# EAGLE design USBm1P_0v0 (EAGLE 9.6.2)
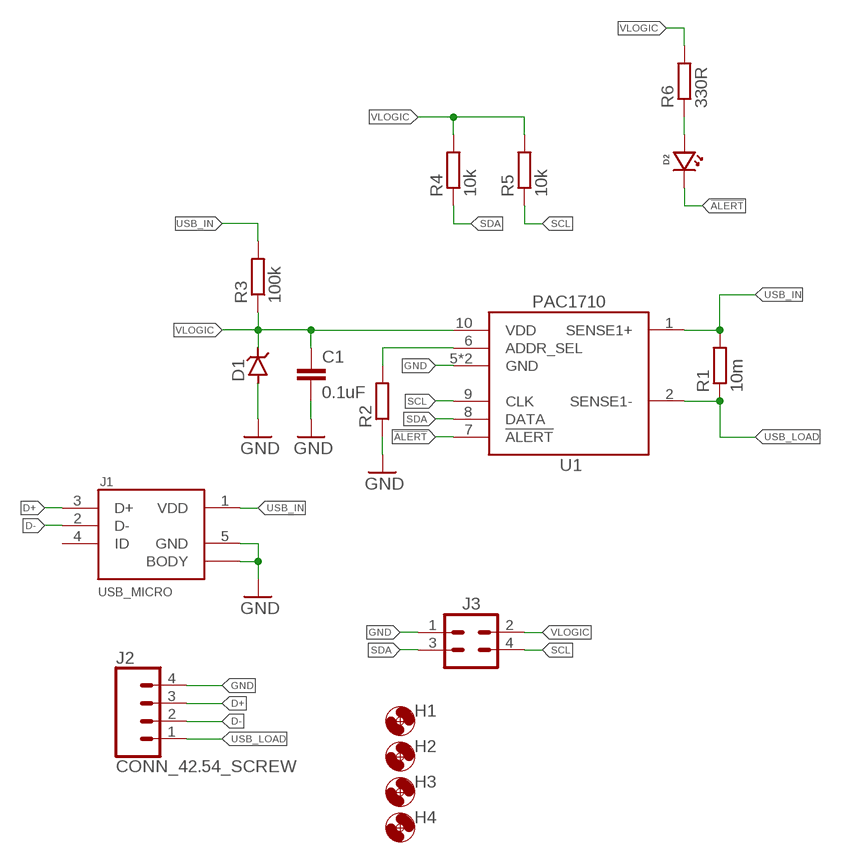
[diagram p0: schematic, sheet 1]

## Parts
C1  0.1uF  C-EU0.1UFC0603  [C0603]
D1  DIODE_ZENERSOD-123  [SOD-123]
D2  LED1206_BOTTOM  [LED_1206_BOTTOM]
H1  MOUNTING_HOLE2_NP  [2_56]
H2  MOUNTING_HOLE2_NP  [2_56]
H3  MOUNTING_HOLE2_NP  [2_56]
H4  MOUNTING_HOLE2_NP  [2_56]
J1  USB_MICRO  [10118194-0001LF_10118194-0001LF_LONGER_PADS]
J2  CONN_42.54_SCREW  [1X04_SCREW]
J3  CONN_2X2MIRCOFIT_RT  [2X2_MICROFIT_RT]
R1  10m  R-EU_0.01R0805  [R0805]
R2  R-EU_R0603  [R0603]
R3  100k  R-EU_100KR0603  [R0603]
R4  10k  R-EU_10KR0603  [R0603]
R5  10k  R-EU_10KR0603  [R0603]
R6  330R  R-EU_330R0603  [R0603]
U1  PAC1710  [VDFN-10]

## Nets
!ALERT: D2.CATHODE U1.7(!ALERT)
D+: J1.3(D+) J2.3
D-: J1.2(D-) J2.2
GND: C1.2 D1.ANODE(A) J1.5(GND) J1.BODY@1(BODY) J1.BODY@2(BODY) J1.BODY@3(BODY) J1.BODY@4(BODY) J1.BODY@7(BODY) J1.BODY@8(BODY) J2.4 J3.1 R2.1 U1.5(GND) U1.EP(GND)
N$1: R2.2 U1.6(ADDR_SEL)
N$2: D2.ANODE R6.1
SCL: J3.4 R5.1 U1.9(CLK)
SDA: J3.3 R4.1 U1.8(DATA)
USB_IN: J1.1(VDD) R1.2 R3.2 U1.1(SENSE1+)
USB_LOAD: J2.1 R1.1 U1.2(SENSE1-)
VLOGIC: C1.1 D1.CAT(C) J3.2 R3.1 R4.2 R5.2 R6.2 U1.10(VDD)
Unconnected: J1.4(ID)

## Library data of the parts
C1 = bschulz_passives:C-EU: CAPACITOR, European symbol; DIGIKEY: 490-6051-1-ND; MF: Murata; MPN: GCM188R71E104KA57D
D1 = bschulz:DIODE_ZENER: Generic Zener Diode
D2 = bschulz:LED: Genaric LED
H1-H4 = bschulz:MOUNTING_HOLE: Genaric Mechanical Mounting Hole Hole diameter based on max body diameter + 15% Keepout ring is for diameter of socket cap screw (minimum required clearance) TPlace ring is for diameter of pan head screw (recomended clearance) Specifications: Socket Cap <http://fastener-express.com/fastener-technical/SocketscapSS-Alloy.pdf> Button Head Socket Cap <http://fastener-express.com/fastener-technical/Button-Socket-alloy.pdf> Pan Head <http://fastener-express.com/fastener-technical/pan-machine-Screws.pdf>; DIGIKEY: DNP; MF: N/A; MPN: DNP
J1 = bschulz:USB_MICRO: General Micro USB - AB Connector; DIGIKEY: 609-4618-1-ND; MF: Amphenol; MPN: 10118194-0001LF
J2 = bschulz:CONN_4: Genaric 4 terminal header Digikey 2.54_SCREW <https://www.digikey.com/product-detail/en/on-shore-technology-inc/OSTVN04A150/ED10563-ND/1588864>; DIGIKEY: ED10563-ND; MF: On Shore; MPN: OSTVN04A150
J3 = bschulz:CONN_2X2: Genaric 2x2 terminal header; DIGIKEY: WM1814-ND; MF: Molex; MPN: 0430450400
R1 = bschulz_passives:R-EU_: RESISTOR, European symbol Digikey Parts: Yageo, 0402 <https://www.digikey.com/products/en/resistors/chip-resistor-surface-mount/52?k=&pkeyword=&sv=0&s=4356&sf=1&FV=-1%7C13%2C7%7C2%2C1291%7C39157%2C1989%7C0%2C-8%7C52%2C3%7C1131%2C3%7C2503&quantity=&ColumnSort=0&page=1&stock=1&pageSize=25> Yageo, 0603 <https://www.digikey.com/products/en/resistors/chip-resistor-surface-mount/52?k=&pkeyword=&sv=0&pv1291=39245&sf=1&FV=-5%7C4356%2C-5%7C47360%2C-8%7C52%2C-1%7C13%2C7%7C2%2C1989%7C0&quantity=10&ColumnSort=1000011&page=1&stock=1&pageSize=25> Panasonic, 0603 <https://www.digikey.com/products/en/resistors/chip-resistor-surface-mount/52?k=&pkeyword=&pv252=68&sf=0&FV=ffec373d%2C1c0002%2C142c040c%2C1f140000%2Cffe00034%2C80002%2Cc0001&quantity=&ColumnSort=0&page=1&stock=1&pageSize=25> Panasonic, precision, 0603 <https://www.digikey.com/products/en/resistors/chip-resistor-surface-mount/52?FV=ffec4907%2Cfffc000a%2Cc0172%2C142c040c%2C1f140000%2Cffe00034%2C1c0002&quantity=100&ColumnSort=2085&page=1&stock=1&pageSize=25> Panasonic, 0805 <https://www.digikey.com/products/en/resistors/chip-resistor-surface-mount/52?k=&pkeyword=&pv3=1&sf=0&FV=ffec373d%2C1c0002%2C1f140000%2Cffe00034%2C142c040d&quantity=&ColumnSort=0&page=1&stock=1&pageSize=25> Rohm, current sense <https://www.digikey.com/products/en/resistors/chip-resistor-surface-mount/52?k=&pkeyword=&pv3=1&sf=0&FV=ffecb688%2C1f140000%2Cffe00034%2C1c0002&quantity=&ColumnSort=0&page=1&stock=1&pageSize=25> Vishay, pulse proof automotive <https://www.digikey.com/products/en/resistors/chip-resistor-surface-mount/52?k=&pkeyword=&pv7=2&sf=0&FV=ffec5d6b%2Cffe00034%2C1f140000&quantity=&ColumnSort=0&page=1&stock=1&pageSize=25>; DIGIKEY: CRF0805-FZ-R010ELFCT-ND; MF: Bourns; MPN: CRF0805-FZ-R010ELF
R2 = bschulz_passives:R-EU_: RESISTOR, European symbol Digikey Parts: Yageo, 0402 <https://www.digikey.com/products/en/resistors/chip-resistor-surface-mount/52?k=&pkeyword=&sv=0&s=4356&sf=1&FV=-1%7C13%2C7%7C2%2C1291%7C39157%2C1989%7C0%2C-8%7C52%2C3%7C1131%2C3%7C2503&quantity=&ColumnSort=0&page=1&stock=1&pageSize=25> Yageo, 0603 <https://www.digikey.com/products/en/resistors/chip-resistor-surface-mount/52?k=&pkeyword=&sv=0&pv1291=39245&sf=1&FV=-5%7C4356%2C-5%7C47360%2C-8%7C52%2C-1%7C13%2C7%7C2%2C1989%7C0&quantity=10&ColumnSort=1000011&page=1&stock=1&pageSize=25> Panasonic, 0603 <https://www.digikey.com/products/en/resistors/chip-resistor-surface-mount/52?k=&pkeyword=&pv252=68&sf=0&FV=ffec373d%2C1c0002%2C142c040c%2C1f140000%2Cffe00034%2C80002%2Cc0001&quantity=&ColumnSort=0&page=1&stock=1&pageSize=25> Panasonic, precision, 0603 <https://www.digikey.com/products/en/resistors/chip-resistor-surface-mount/52?FV=ffec4907%2Cfffc000a%2Cc0172%2C142c040c%2C1f140000%2Cffe00034%2C1c0002&quantity=100&ColumnSort=2085&page=1&stock=1&pageSize=25> Panasonic, 0805 <https://www.digikey.com/products/en/resistors/chip-resistor-surface-mount/52?k=&pkeyword=&pv3=1&sf=0&FV=ffec373d%2C1c0002%2C1f140000%2Cffe00034%2C142c040d&quantity=&ColumnSort=0&page=1&stock=1&pageSize=25> Rohm, current sense <https://www.digikey.com/products/en/resistors/chip-resistor-surface-mount/52?k=&pkeyword=&pv3=1&sf=0&FV=ffecb688%2C1f140000%2Cffe00034%2C1c0002&quantity=&ColumnSort=0&page=1&stock=1&pageSize=25> Vishay, pulse proof automotive <https://www.digikey.com/products/en/resistors/chip-resistor-surface-mount/52?k=&pkeyword=&pv7=2&sf=0&FV=ffec5d6b%2Cffe00034%2C1f140000&quantity=&ColumnSort=0&page=1&stock=1&pageSize=25>; MF: Yageo
R3 = bschulz_passives:R-EU_: RESISTOR, European symbol Digikey Parts: Yageo, 0402 <https://www.digikey.com/products/en/resistors/chip-resistor-surface-mount/52?k=&pkeyword=&sv=0&s=4356&sf=1&FV=-1%7C13%2C7%7C2%2C1291%7C39157%2C1989%7C0%2C-8%7C52%2C3%7C1131%2C3%7C2503&quantity=&ColumnSort=0&page=1&stock=1&pageSize=25> Yageo, 0603 <https://www.digikey.com/products/en/resistors/chip-resistor-surface-mount/52?k=&pkeyword=&sv=0&pv1291=39245&sf=1&FV=-5%7C4356%2C-5%7C47360%2C-8%7C52%2C-1%7C13%2C7%7C2%2C1989%7C0&quantity=10&ColumnSort=1000011&page=1&stock=1&pageSize=25> Panasonic, 0603 <https://www.digikey.com/products/en/resistors/chip-resistor-surface-mount/52?k=&pkeyword=&pv252=68&sf=0&FV=ffec373d%2C1c0002%2C142c040c%2C1f140000%2Cffe00034%2C80002%2Cc0001&quantity=&ColumnSort=0&page=1&stock=1&pageSize=25> Panasonic, precision, 0603 <https://www.digikey.com/products/en/resistors/chip-resistor-surface-mount/52?FV=ffec4907%2Cfffc000a%2Cc0172%2C142c040c%2C1f140000%2Cffe00034%2C1c0002&quantity=100&ColumnSort=2085&page=1&stock=1&pageSize=25> Panasonic, 0805 <https://www.digikey.com/products/en/resistors/chip-resistor-surface-mount/52?k=&pkeyword=&pv3=1&sf=0&FV=ffec373d%2C1c0002%2C1f140000%2Cffe00034%2C142c040d&quantity=&ColumnSort=0&page=1&stock=1&pageSize=25> Rohm, current sense <https://www.digikey.com/products/en/resistors/chip-resistor-surface-mount/52?k=&pkeyword=&pv3=1&sf=0&FV=ffecb688%2C1f140000%2Cffe00034%2C1c0002&quantity=&ColumnSort=0&page=1&stock=1&pageSize=25> Vishay, pulse proof automotive <https://www.digikey.com/products/en/resistors/chip-resistor-surface-mount/52?k=&pkeyword=&pv7=2&sf=0&FV=ffec5d6b%2Cffe00034%2C1f140000&quantity=&ColumnSort=0&page=1&stock=1&pageSize=25>; DIGIKEY: 311-100KHRCT-ND; MF: Yageo; MPN: RC0603FR-07100KL; VALUE_PART: 100k
R4 R5 = bschulz_passives:R-EU_: RESISTOR, European symbol Digikey Parts: Yageo, 0402 <https://www.digikey.com/products/en/resistors/chip-resistor-surface-mount/52?k=&pkeyword=&sv=0&s=4356&sf=1&FV=-1%7C13%2C7%7C2%2C1291%7C39157%2C1989%7C0%2C-8%7C52%2C3%7C1131%2C3%7C2503&quantity=&ColumnSort=0&page=1&stock=1&pageSize=25> Yageo, 0603 <https://www.digikey.com/products/en/resistors/chip-resistor-surface-mount/52?k=&pkeyword=&sv=0&pv1291=39245&sf=1&FV=-5%7C4356%2C-5%7C47360%2C-8%7C52%2C-1%7C13%2C7%7C2%2C1989%7C0&quantity=10&ColumnSort=1000011&page=1&stock=1&pageSize=25> Panasonic, 0603 <https://www.digikey.com/products/en/resistors/chip-resistor-surface-mount/52?k=&pkeyword=&pv252=68&sf=0&FV=ffec373d%2C1c0002%2C142c040c%2C1f140000%2Cffe00034%2C80002%2Cc0001&quantity=&ColumnSort=0&page=1&stock=1&pageSize=25> Panasonic, precision, 0603 <https://www.digikey.com/products/en/resistors/chip-resistor-surface-mount/52?FV=ffec4907%2Cfffc000a%2Cc0172%2C142c040c%2C1f140000%2Cffe00034%2C1c0002&quantity=100&ColumnSort=2085&page=1&stock=1&pageSize=25> Panasonic, 0805 <https://www.digikey.com/products/en/resistors/chip-resistor-surface-mount/52?k=&pkeyword=&pv3=1&sf=0&FV=ffec373d%2C1c0002%2C1f140000%2Cffe00034%2C142c040d&quantity=&ColumnSort=0&page=1&stock=1&pageSize=25> Rohm, current sense <https://www.digikey.com/products/en/resistors/chip-resistor-surface-mount/52?k=&pkeyword=&pv3=1&sf=0&FV=ffecb688%2C1f140000%2Cffe00034%2C1c0002&quantity=&ColumnSort=0&page=1&stock=1&pageSize=25> Vishay, pulse proof automotive <https://www.digikey.com/products/en/resistors/chip-resistor-surface-mount/52?k=&pkeyword=&pv7=2&sf=0&FV=ffec5d6b%2Cffe00034%2C1f140000&quantity=&ColumnSort=0&page=1&stock=1&pageSize=25>; DIGIKEY: 311-10.0KHRCT-ND; MF: Yageo; MPN: RC0603FR-0710KL; VALUE_PART: 10k
R6 = bschulz_passives:R-EU_: RESISTOR, European symbol Digikey Parts: Yageo, 0402 <https://www.digikey.com/products/en/resistors/chip-resistor-surface-mount/52?k=&pkeyword=&sv=0&s=4356&sf=1&FV=-1%7C13%2C7%7C2%2C1291%7C39157%2C1989%7C0%2C-8%7C52%2C3%7C1131%2C3%7C2503&quantity=&ColumnSort=0&page=1&stock=1&pageSize=25> Yageo, 0603 <https://www.digikey.com/products/en/resistors/chip-resistor-surface-mount/52?k=&pkeyword=&sv=0&pv1291=39245&sf=1&FV=-5%7C4356%2C-5%7C47360%2C-8%7C52%2C-1%7C13%2C7%7C2%2C1989%7C0&quantity=10&ColumnSort=1000011&page=1&stock=1&pageSize=25> Panasonic, 0603 <https://www.digikey.com/products/en/resistors/chip-resistor-surface-mount/52?k=&pkeyword=&pv252=68&sf=0&FV=ffec373d%2C1c0002%2C142c040c%2C1f140000%2Cffe00034%2C80002%2Cc0001&quantity=&ColumnSort=0&page=1&stock=1&pageSize=25> Panasonic, precision, 0603 <https://www.digikey.com/products/en/resistors/chip-resistor-surface-mount/52?FV=ffec4907%2Cfffc000a%2Cc0172%2C142c040c%2C1f140000%2Cffe00034%2C1c0002&quantity=100&ColumnSort=2085&page=1&stock=1&pageSize=25> Panasonic, 0805 <https://www.digikey.com/products/en/resistors/chip-resistor-surface-mount/52?k=&pkeyword=&pv3=1&sf=0&FV=ffec373d%2C1c0002%2C1f140000%2Cffe00034%2C142c040d&quantity=&ColumnSort=0&page=1&stock=1&pageSize=25> Rohm, current sense <https://www.digikey.com/products/en/resistors/chip-resistor-surface-mount/52?k=&pkeyword=&pv3=1&sf=0&FV=ffecb688%2C1f140000%2Cffe00034%2C1c0002&quantity=&ColumnSort=0&page=1&stock=1&pageSize=25> Vishay, pulse proof automotive <https://www.digikey.com/products/en/resistors/chip-resistor-surface-mount/52?k=&pkeyword=&pv7=2&sf=0&FV=ffec5d6b%2Cffe00034%2C1f140000&quantity=&ColumnSort=0&page=1&stock=1&pageSize=25>; DIGIKEY: 311-330HRCT-ND; MF: Yageo; MPN: RC0603FR-07330RL; VALUE_PART: 330
U1 = bschulz:PAC1710: PAC1710 - High Side Current/Power Monitor with I2C Interface Characteristics: Vcc: 3V ~ 5.5V Iq: 5uA Common Mode Range: 0V ~ 40V Operating Temperature: -40°C to 85°C Digikey: PAC1720-1-AIA-CT-ND <https://www.digikey.com/product-detail/en/microchip-technology/PAC1710-1-AIA-TR/PAC1710-1-AIA-CT-ND/4490171>; DIGIKEY: PAC1710-1-AIA-CT-ND; MF: Microchip; MPN: PAC1710-1-AIA-TR

## Board
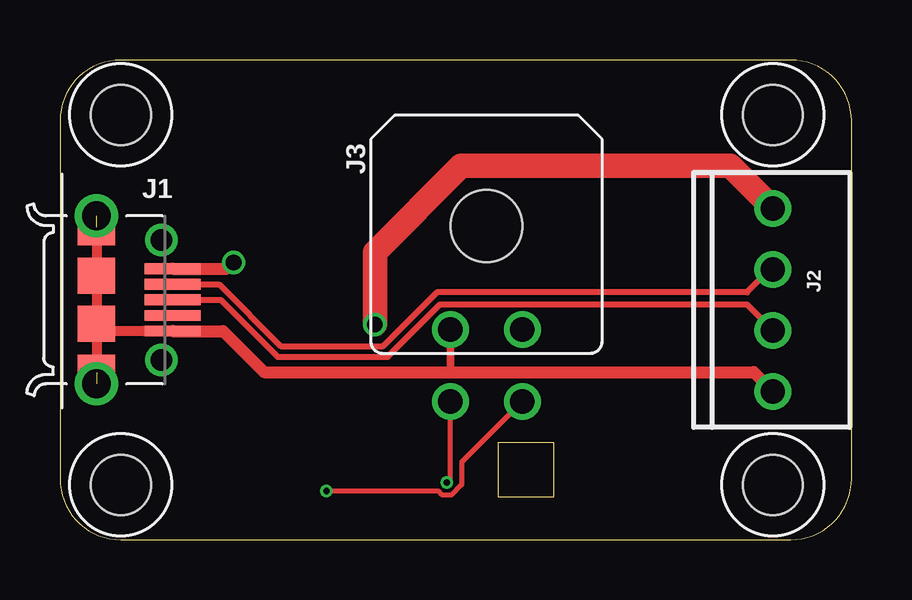
[diagram p1: board, top side]
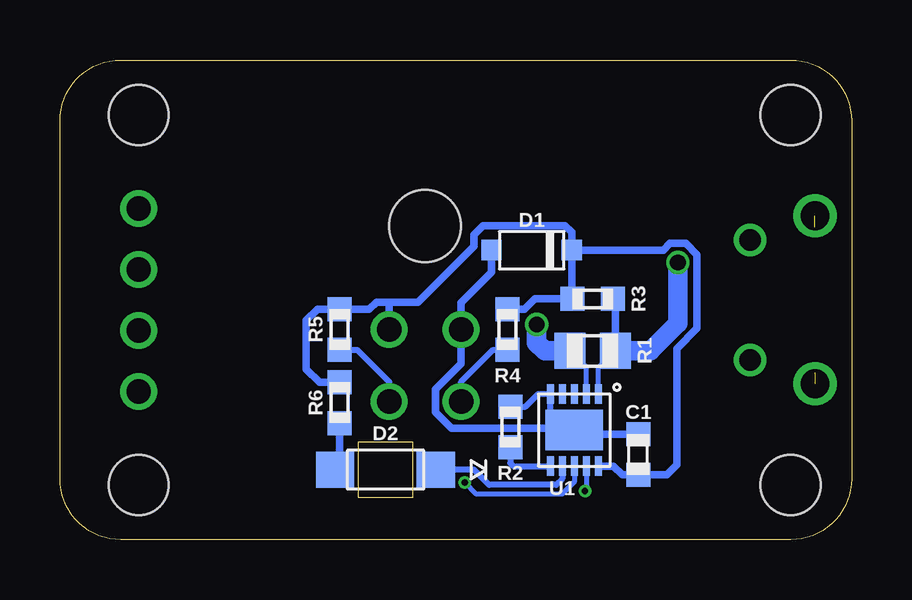
[diagram p2: board, bottom side, seen from below]

Size 33 x 19.99 mm. Coordinates in mm from the lower left corner, seen from the top.
Outline: 33,2.54 33,17.45 arc90 30.46,19.99 2.54,19.99 arc90 0,17.45 0,2.54 arc90 2.54,0 30.46,0 arc90 33,2.54
Copper layers (1*16): Top 0.035559375mm / dielectric 1.6mm / Bottom 0.035559375mm
Design rules "oshpark-2layer": minimum track width 6mil, minimum drill 10mil, track to track 6mil, track to pad 6mil, pad to pad 6mil, via to via 6mil, smd to smd 6mil, copper to edge 15mil, drill to drill 6mil, minimum pad ring 5mil, minimum via ring 5mil, stop-mask expansion 2.5mil, vias tented up to drill 0mil, thermal gap 10mil

### Footprints (pad centres in the part's own frame; a part is rotated, then mirrored left to right if it is on the bottom)
C0603 = smd 1 x 1: 1 -0.85,0; 2 0.85,0
SOD-123 = smd 0.85 x 0.85: ANODE 1.675,0; CAT -1.675,0
LED_1206_BOTTOM = smd 1.6 x 1.5: ANODE 2.1,0; CATHODE -2.1,0
2_56 = hole 2.5: 0,0
10118194-0001LF_10118194-0001LF_LONGER_PADS = smd 0.45 x 2.35: 1 -1.3,3.175; 2 -0.65,3.175; 3 0,3.175; 4 0.65,3.175; 5 1.3,3.175 | drill 0.9: BBODY@1 -2.5,2.7; BBODY@2 2.5,2.7 | drill 1.2: BODY@1 -3.5,0; BODY@4 3.5,0 | smd 1.5 x 1.55: BODY@2 -1,0; BODY@3 1,0; BODY@7 -3.032,0; BODY@8 3.032,0
1X04_SCREW = drill 1.016: 1 -3.81,0; 2 -1.27,0; 3 1.27,0; 4 3.81,0
2X2_MICROFIT_RT = drill 1.02: 1 1.5,4.32; 2 -1.5,4.32; 3 1.5,7.32; 4 -1.5,7.32 | hole 3: 0,0
R0805 = smd 1.3 x 1.5: 1 -0.95,0; 2 0.95,0
R0603 = smd 1 x 1: 1 -0.85,0; 2 0.85,0
VDFN-10 = smd 0.8 x 0.3: 1 -1.5,1; 2 -1.5,0.5; 3 -1.5,0; 4 -1.5,-0.5; 5 -1.5,-1; 6 1.5,-1; 7 1.5,-0.5; 8 1.5,0; 9 1.5,0.5; 10 1.5,1 | smd 1.7 x 2.4: EP 0,0

### Placement (x,y rotation side)
C1  8.89,3.56 90 bottom
D1  13.34,12.06 180 bottom
D2  19.43,2.92 180 bottom
H1  29.72,2.29 0 top
H2  29.72,17.7 0 top
H3  2.54,2.29 0 top
H4  2.54,17.7 0 top
J1  1.52,9.99 270 top
J2  29.72,9.99 270 top
J3  17.78,13.08 180 top
R1  10.79,7.87 0 bottom
R2  14.22,4.7 270 bottom
R3  10.79,10.03 0 bottom
R4  14.35,8.76 90 bottom
R5  21.34,8.76 90 bottom
R6  21.34,5.71 90 bottom
U1  11.56,4.57 270 bottom

### Tracks (layer width: path | path; a pad name or v marks a point on that pad's centre or on a via)
!ALERT
  Bottom 0.254: U1.7 12.06,2.55 12.32,2.29 15.11,2.29 15.75,2.92 D2.CATHODE
D+
  Top 0.254: J2.3 28.64,9.8 15.85,9.8 13.66,7.62 9.08,7.62 6.7,9.99 J1.3
D-
  Top 0.254: J2.2 29.59,11.27 28.64,10.31 15.71,10.31 13.48,8.07 9.2,8.07 6.63,10.64 J1.2
GND  (2 unrouted)
  Top 0.305: J3.1 16.28,7.01 16.26,6.99
  Top 0.406: J1.BODY@7 J1.BODY@2 J1.BODY@3 | J1.BODY@3 J1.BODY@4 | J1.5 1.82,8.7 J1.BODY@3
  Top 0.508: J1.5 6.8,8.7 8.51,6.99 16.26,6.99 28.92,6.99 J2.4
  Bottom 0.254: 12.45,4.57 12.56,4.68 U1.5 13.06,6.07 13.59,5.55 R2.1 | 12.45,4.57 12.06,4.19 | U1.EP 12.45,4.57
  Bottom 0.305: C1.2 11.39,4.41 U1.EP 11.64,4.65 16.69,4.65 17.35,5.32 17.35,6.27 16.28,7.34 J3.1 16.28,9.88 15.01,11.15 D1.ANODE
N$1
  Bottom 0.254: R2.2 14.22,3.19 14.1,3.07 U1.6
N$2
  Bottom 0.305: D2.ANODE 21.34,3.12 R6.1
SCL  (via drill 0.25)
  Top 0.2: v11.11,2.03 15.76,2.03 15.91,1.88 16.33,1.88 16.74,2.29 16.74,3.22 J3.4
  Bottom 0.2: U1.9 11.06,2.08 v11.11,2.03
  Bottom 0.254: R5.1 20.61,7.91 19.28,6.58 J3.4
SDA  (via drill 0.25)
  Top 0.2: v16.12,2.39 16.28,2.54 J3.3
  Bottom 0.2: U1.8 11.56,2.41 12.06,1.91 15.64,1.91 v16.12,2.39
  Bottom 0.254: J3.3 16.28,6.58 14.95,7.91 R4.1
USB_IN  (via drill 0.65)
  Top 0.508: J1.1 6.98,11.29 v7.24,11.56
  Bottom 0.2: U1.1 10.56,7.16 R1.2
  Bottom 0.305: R1.2 9.85,9.93 R3.2
  Bottom 0.813: v7.24,11.56 7.24,9.02 8.38,7.87 R1.2
USB_LOAD  (via drill 0.65)
  Top 1.016: J2.1 27.94,15.58 16.73,15.58 13.12,11.98 v13.12,8.97
  Bottom 0.2: U1.2 11.06,7.19 R1.1
  Bottom 0.813: v13.12,8.97 13.12,8.21 12.79,7.87 R1.1
VLOGIC
  Bottom 0.305: R6.2 22.19,6.57 22.73,7.11 22.73,9.14 22.26,9.61 R5.2 20.11,9.61 19.81,9.91 19.3,9.91 | U1.10 9.92,3.07 9.56,2.71 C1.1 7.71,2.71 7.29,3.12 7.29,7.96 6.45,8.8 6.45,11.88 6.91,12.35 7.57,12.35 7.85,12.06 D1.CAT | D1.CAT 11.66,10.05 R3.1 13.21,10.03 13.63,9.61 R4.2 | D1.CAT 11.66,12.8 11.94,13.08 15.37,13.08 15.75,12.7 15.75,12.24 18.08,9.91 19.3,9.91 | J3.2 19.28,9.88 19.3,9.91

### Text on the board
tDocu: CSR: 50mΩ | 5V | D- | D+ | GND | ALERT | Project-Corvus / USBm1P - v0.0 / Bobby Schulz